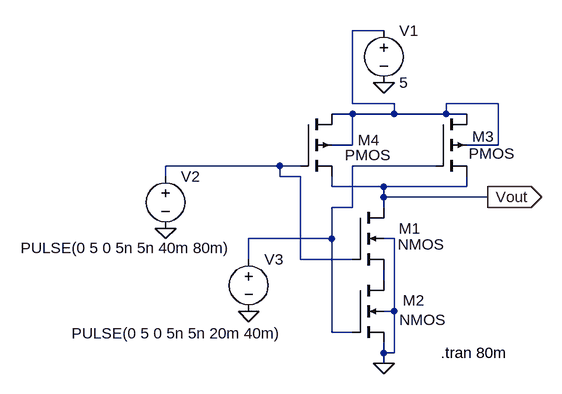
[diagram p0: schematic NAND GATE.asc]
NAND GATE.asc, the LTspice schematic file:
Version 4.1
SHEET 1 880 680
WIRE 128 -224 80 -224
WIRE 80 -112 80 -224
WIRE 144 -112 80 -112
WIRE 304 -112 224 -112
WIRE 80 -96 48 -96
WIRE 144 -96 144 -112
WIRE 144 -96 80 -96
WIRE 224 -96 224 -112
WIRE 224 -96 144 -96
WIRE 256 -96 224 -96
WIRE 80 -48 80 -96
WIRE 80 -48 48 -48
WIRE 304 -48 304 -112
WIRE 304 -48 256 -48
WIRE -32 -16 -208 -16
WIRE 0 -16 -32 -16
WIRE 208 -16 80 -16
WIRE -208 0 -208 -16
WIRE -32 0 -32 -16
WIRE 0 0 -32 0
WIRE 48 16 48 0
WIRE 128 16 48 16
WIRE 256 16 256 0
WIRE 256 16 128 16
WIRE 128 32 128 16
WIRE 288 32 128 32
WIRE 80 48 80 -16
WIRE 80 48 48 48
WIRE 128 48 128 32
WIRE 48 96 48 48
WIRE 48 96 -80 96
WIRE 144 96 128 96
WIRE -80 128 -80 96
WIRE 0 128 0 0
WIRE 80 128 0 128
WIRE 128 160 128 144
WIRE 144 208 144 96
WIRE 144 208 128 208
WIRE 48 240 48 96
WIRE 80 240 48 240
WIRE 128 272 128 256
WIRE 144 272 144 208
WIRE 144 272 128 272
WIRE 128 288 128 272
FLAG 128 -144 0
FLAG -208 80 0
FLAG -80 208 0
FLAG 128 288 0
FLAG 288 32 Vout
IOPIN 288 32 Out
SYMBOL nmos4 80 48 R0
WINDOW 0 71 32 Left 2
WINDOW 3 70 57 Left 2
SYMATTR InstName M1
SYMBOL nmos4 80 160 R0
WINDOW 0 77 31 Left 2
WINDOW 3 72 61 Left 2
SYMATTR InstName M2
SYMBOL pmos4 208 -96 R0
WINDOW 0 56 35 Left 2
WINDOW 3 51 61 Left 2
SYMATTR InstName M3
SYMBOL pmos4 0 -96 R0
WINDOW 0 88 40 Left 2
WINDOW 3 68 63 Left 2
SYMATTR InstName M4
SYMBOL voltage 128 -240 R0
WINDOW 123 0 0 Left 0
WINDOW 39 0 0 Left 0
SYMATTR InstName V1
SYMATTR Value 5
SYMBOL voltage -208 -16 R0
WINDOW 3 -223 126 Left 2
WINDOW 123 0 0 Left 0
WINDOW 39 0 0 Left 0
SYMATTR InstName V2
SYMATTR Value PULSE(0 5 0 5n 5n 40m 80m)
SYMBOL voltage -80 112 R0
WINDOW 3 -273 130 Left 2
WINDOW 123 0 0 Left 0
WINDOW 39 0 0 Left 0
SYMATTR InstName V3
SYMATTR Value PULSE(0 5 0 5n 5n 20m 40m)
TEXT 216 272 Left 2 !.tran 80m

The netlist it stands for:
* NAND GATE.asc
M1 Vout N002 N004 0 NMOS
M2 N004 N003 0 0 NMOS
M3 N001 N003 Vout N001 PMOS
M4 N001 N002 Vout N001 PMOS
V1 N001 0 5
V2 N002 0 PULSE(0 5 0 5n 5n 40m 80m)
V3 N003 0 PULSE(0 5 0 5n 5n 20m 40m)
.model NMOS NMOS
.model PMOS PMOS
.lib standard.mos
.tran 80m
.backanno
.end